# EAGLE schematic Pro1 (EAGLE 7.2.0)
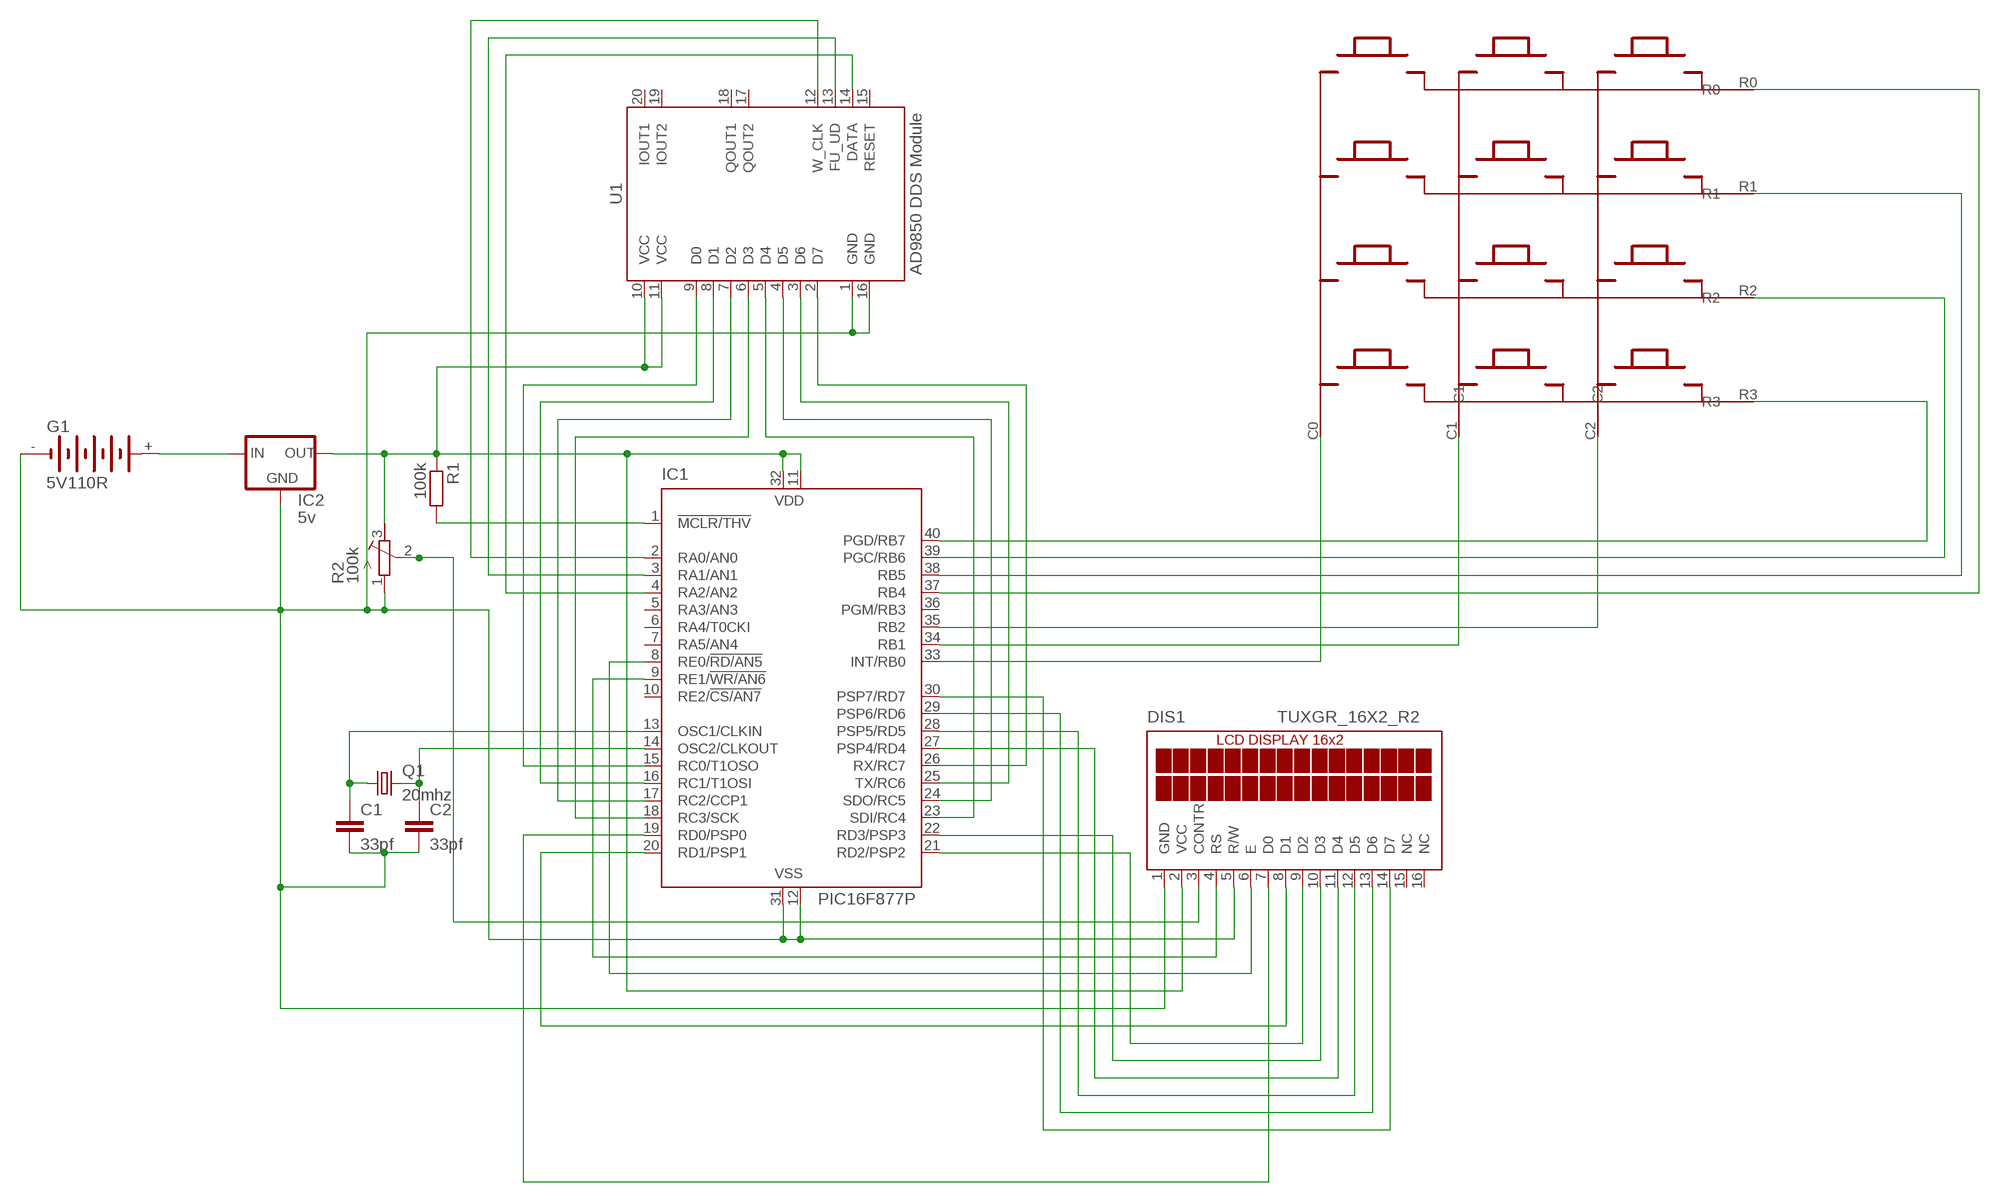
[diagram p0: schematic, sheet 1]

## Parts
C1  33pf  C2,5-3  [C2.5-3]
C2  33pf  C2,5-3  [C2.5-3]
DIS1  TUXGR_16X2_R2  [TUXGR_16X2_R2]
G1  5V110R  [5V110R]
IC1  PIC16F877P  [DIL40]
IC2  5v  78XXL  [78XXL]
KP1  KEYPAD  [KEYPAD]
Q1  20mhz  CRYSTALHC49U-V  [HC49U-V]
R1  100k  R-EU_0204/7  [0204/7]
R2  100k  R-TRIMM74X  [RTRIM74X]
U1  AD9850 DDS Module  DDS_MODULE:AD9850DDS_MODULE  [DDS_AD9850]

## Nets
N$1: DIS1.14(D7) IC1.30(PSP7/RD7)
N$2: DIS1.11(D4) IC1.27(PSP4/RD4)
N$3: DIS1.13(D6) IC1.29(PSP6/RD6)
N$4: DIS1.12(D5) IC1.28(PSP5/RD5)
N$5: DIS1.10(D3) IC1.22(RD3/PSP3)
N$6: DIS1.7(D0) IC1.19(RD0/PSP0)
N$7: DIS1.9(D2) IC1.21(RD2/PSP2)
N$8: DIS1.8(D1) IC1.20(RD1/PSP1)
N$9: IC1.26(RX/RC7) U1.2(D7)
N$10: G1.+ IC2.IN
N$11: C1.2 C2.2 DIS1.1(GND) DIS1.5(R/W) G1.- IC1.12(VSS) IC1.31(VSS) IC2.GND R2.1(A) U1.1(GND) U1.16(GND)
N$12: IC1.15(RC0/T1OSO) U1.9(D0)
N$13: IC1.16(RC1/T1OSI) U1.8(D1)
N$14: IC1.17(RC2/CCP1) U1.7(D2)
N$15: IC1.18(RC3/SCK) U1.6(D3)
N$16: IC1.25(TX/RC6) U1.3(D6)
N$17: IC1.24(SDO/RC5) U1.4(D5)
N$18: IC1.23(SDI/RC4) U1.5(D4)
N$19: DIS1.2(VCC) IC1.11(VDD) IC1.32(VDD) IC2.OUT R1.1 R2.3(E) U1.10(VCC) U1.11(VCC)
N$20: C1.1 IC1.13(OSC1/CLKIN) Q1.1
N$21: C2.1 IC1.14(OSC2/CLKOUT) Q1.2
N$22: IC1.37(RB4) KP1.R0
N$23: IC1.1(!MCLR/THV) R1.2
N$24: IC1.38(RB5) KP1.R1
N$25: IC1.39(PGC/RB6) KP1.R2
N$26: DIS1.6(E) IC1.8(RE0/!RD/AN5)
N$27: DIS1.4(RS) IC1.9(RE1/!WR/AN6)
N$28: DIS1.3(CONTR) R2.2(S)
N$29: IC1.40(PGD/RB7) KP1.R3
N$30: IC1.33(INT/RB0) KP1.C0
N$31: IC1.34(RB1) KP1.C1
N$32: IC1.35(RB2) KP1.C2
N$33: IC1.2(RA0/AN0) U1.12(W_CLK)
N$34: IC1.3(RA1/AN1) U1.13(FU_UD)
N$35: IC1.4(RA2/AN2) U1.14(DATA)
Unconnected: DIS1.15(NC) DIS1.16(NC) G1.+@1(+) IC1.5(RA3/AN3) IC1.6(RA4/T0CKI) IC1.7(RA5/AN4) IC1.10(RE2/!CS/AN7) IC1.36(PGM/RB3) U1.15(RESET) U1.17(QOUT2) U1.18(QOUT1) U1.19(IOUT2) U1.20(IOUT1)

## Library data of the parts
C1 C2 = capacitor-wima:C: CAPACITOR naming: grid - package width
DIS1 = display-lcd:TUXGR_16X2_R2: Tuxgraphics LCD display 16x2 characters reflective, without background light Source: tuxgr_12x2_r2.pdf; OC_FARNELL: unknown; OC_NEWARK: unknown
G1 = battery:5V110R: NC ACCU Varta
IC1 = microchip:PIC16F87*: MICROCONTROLLER; MF: MICROCHIP; MPN: PIC16F877-04/P; OC_FARNELL: 9761349; OC_NEWARK: 61K3463
IC2 = v-reg:78XXL: VOLTAGE REGULATOR
KP1 = KeyPad3x4:KEYPAD
Q1 = crystal:CRYSTAL: CRYSTAL; OC_FARNELL: 1666969; OC_NEWARK: unknown
R1 = resistor:R-EU_: RESISTOR, European symbol
R2 = rcl:R-TRIMM: Trimm resistor
U1 = dds-module-ad9850:DDS_MODULE:AD9850: AD9850 DDS Module Created by Johan Adler, October 2014. Not tested on an actual PCB, so I can't promise anything. Also please check the actual pinout of your specific module. Mine are of the low price eBay version, and the pinout is correct for my modules. The placement of VCC over data pins over GND on the symbol is meant to make it easier to set it up for default serial transfer. For this you would connect D0 and D1 to VCC, D2 to GND. IOUT is analog signal out, sinus wave, QOUT is square wave. Outputs 1 are normal, outputs 2 are inverted.